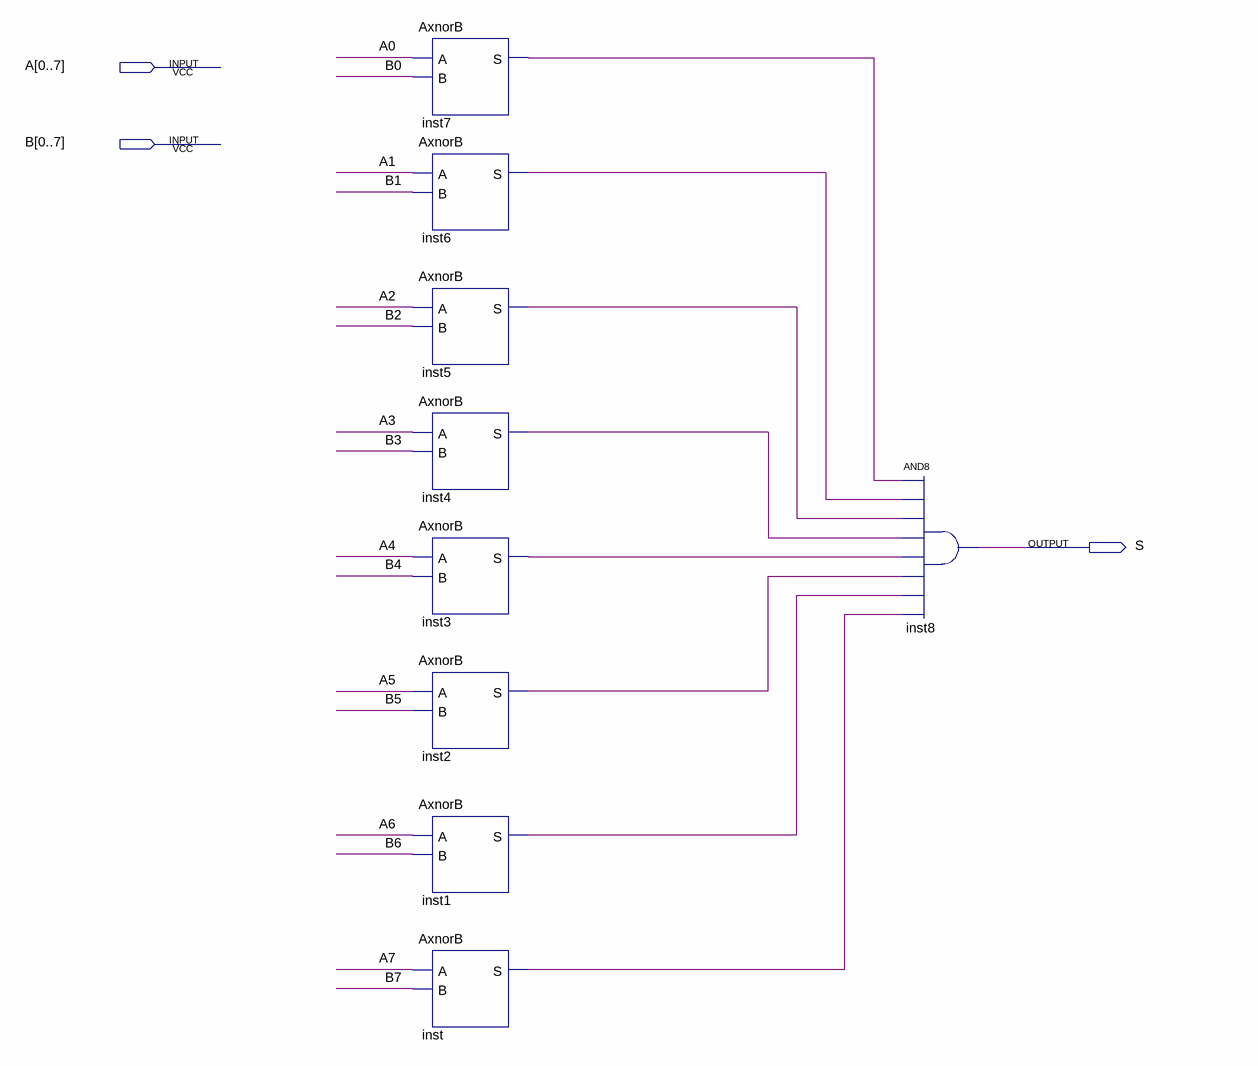
[diagram p0: schematic sheet]
// Quartus schematic AxnorB8bits.bdf as structural Verilog: 9 symbols, 3 pins
module AxnorB8bits (
  input  [0:7] A,
  input  [0:7] B,
  output S
);

  wire inst1_s, inst2_s, inst3_s, inst4_s, inst5_s, inst6_s, inst7_s, inst_s;

  AxnorB inst7 (.A(A[0]), .B(B[0]), .S(inst7_s));
  AxnorB inst6 (.A(A[1]), .B(B[1]), .S(inst6_s));
  AxnorB inst5 (.A(A[2]), .B(B[2]), .S(inst5_s));
  AxnorB inst4 (.A(A[3]), .B(B[3]), .S(inst4_s));
  AxnorB inst3 (.A(A[4]), .B(B[4]), .S(inst3_s));
  AxnorB inst2 (.A(A[5]), .B(B[5]), .S(inst2_s));
  AxnorB inst1 (.A(A[6]), .B(B[6]), .S(inst1_s));
  AxnorB inst (.A(A[7]), .B(B[7]), .S(inst_s));
  and inst8 (S, inst7_s, inst6_s, inst5_s, inst4_s, inst3_s, inst2_s, inst1_s, inst_s);
endmodule
